# EAGLE board ESP32-P4 Display 9.0 inch V1.1 (EAGLE 9.6.2), part 1 of 3
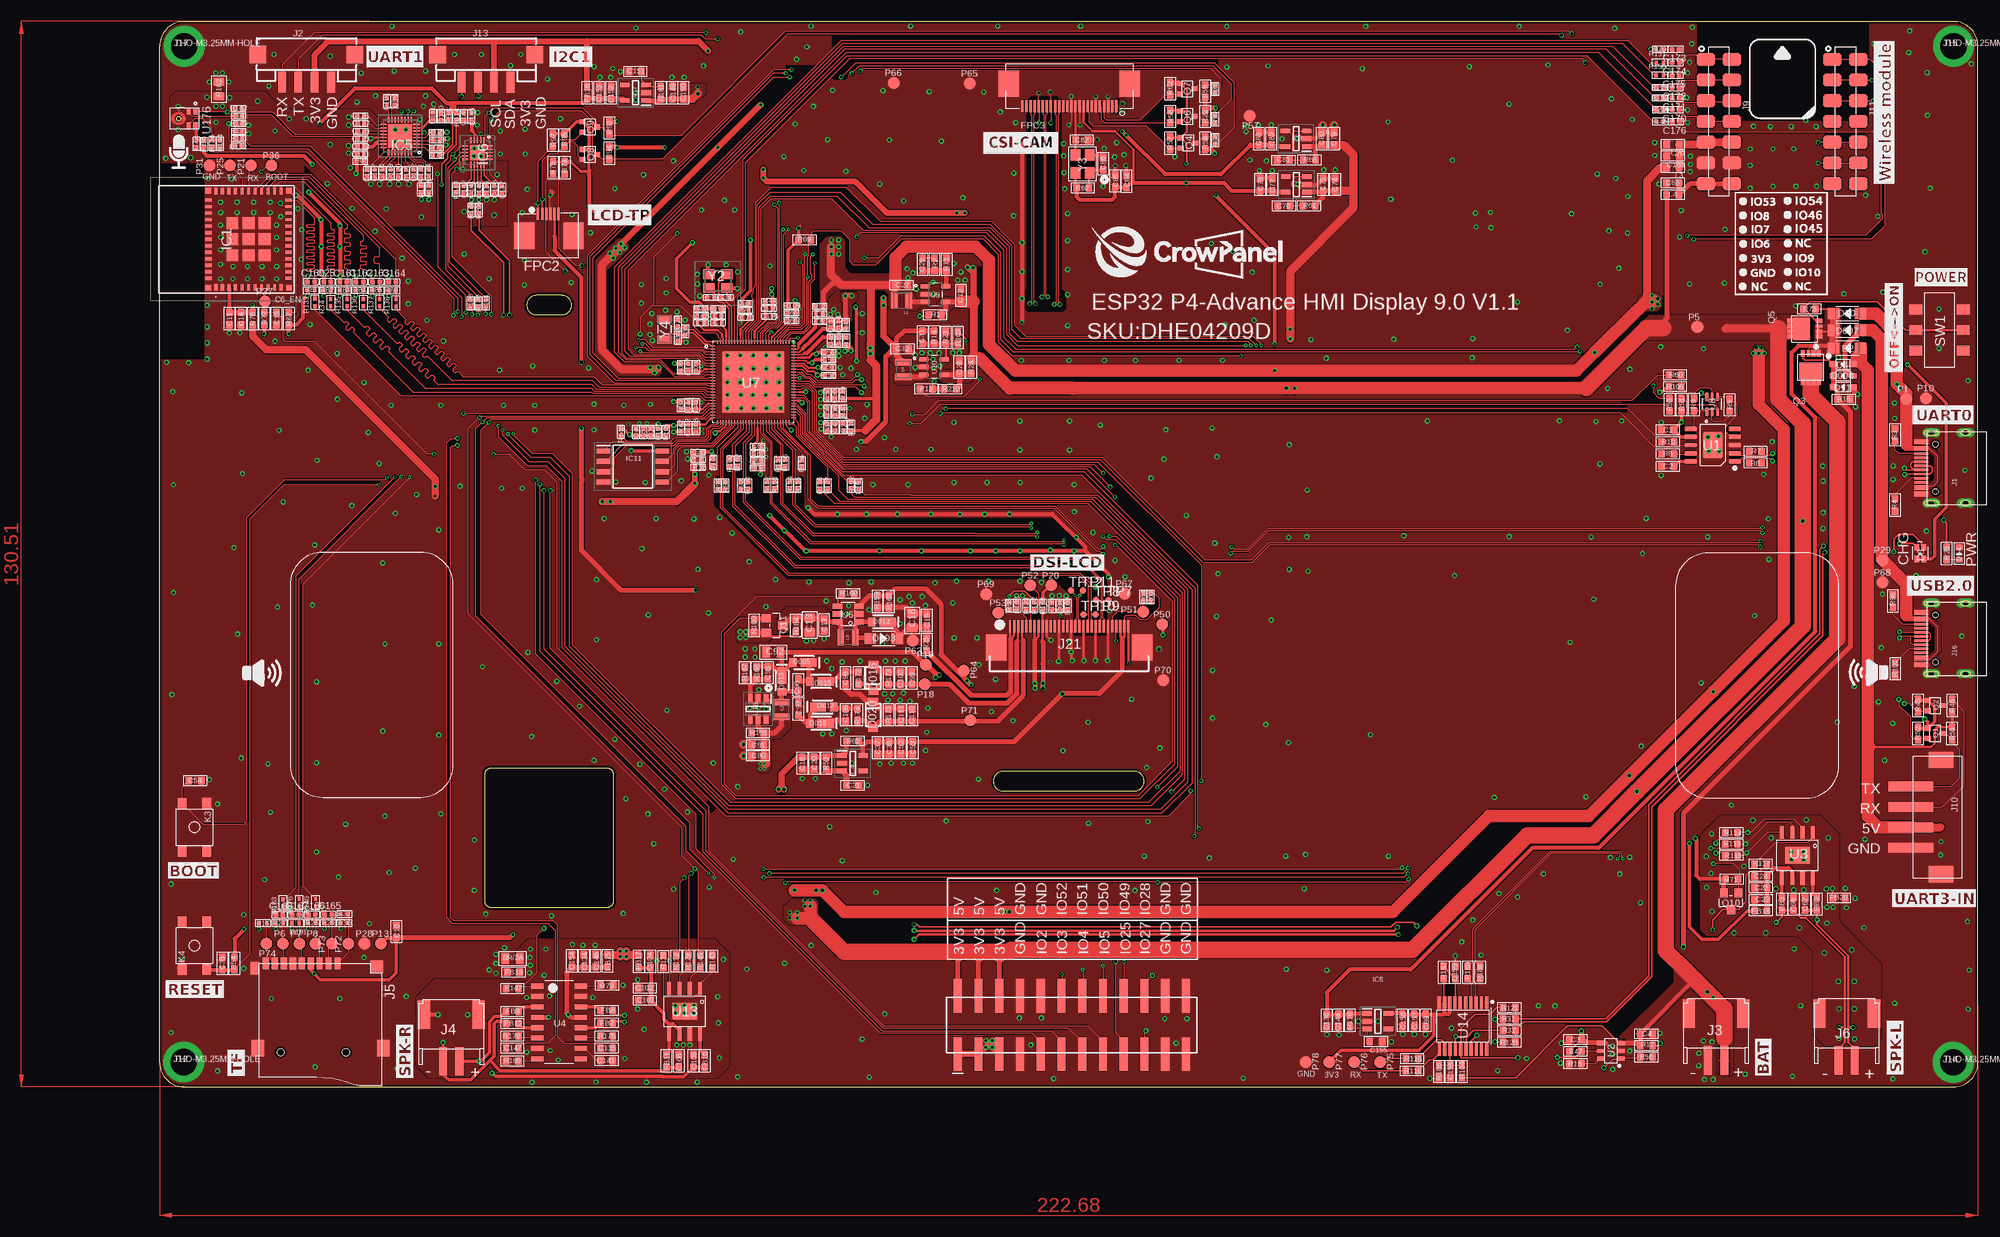
[diagram p9: board, top side]
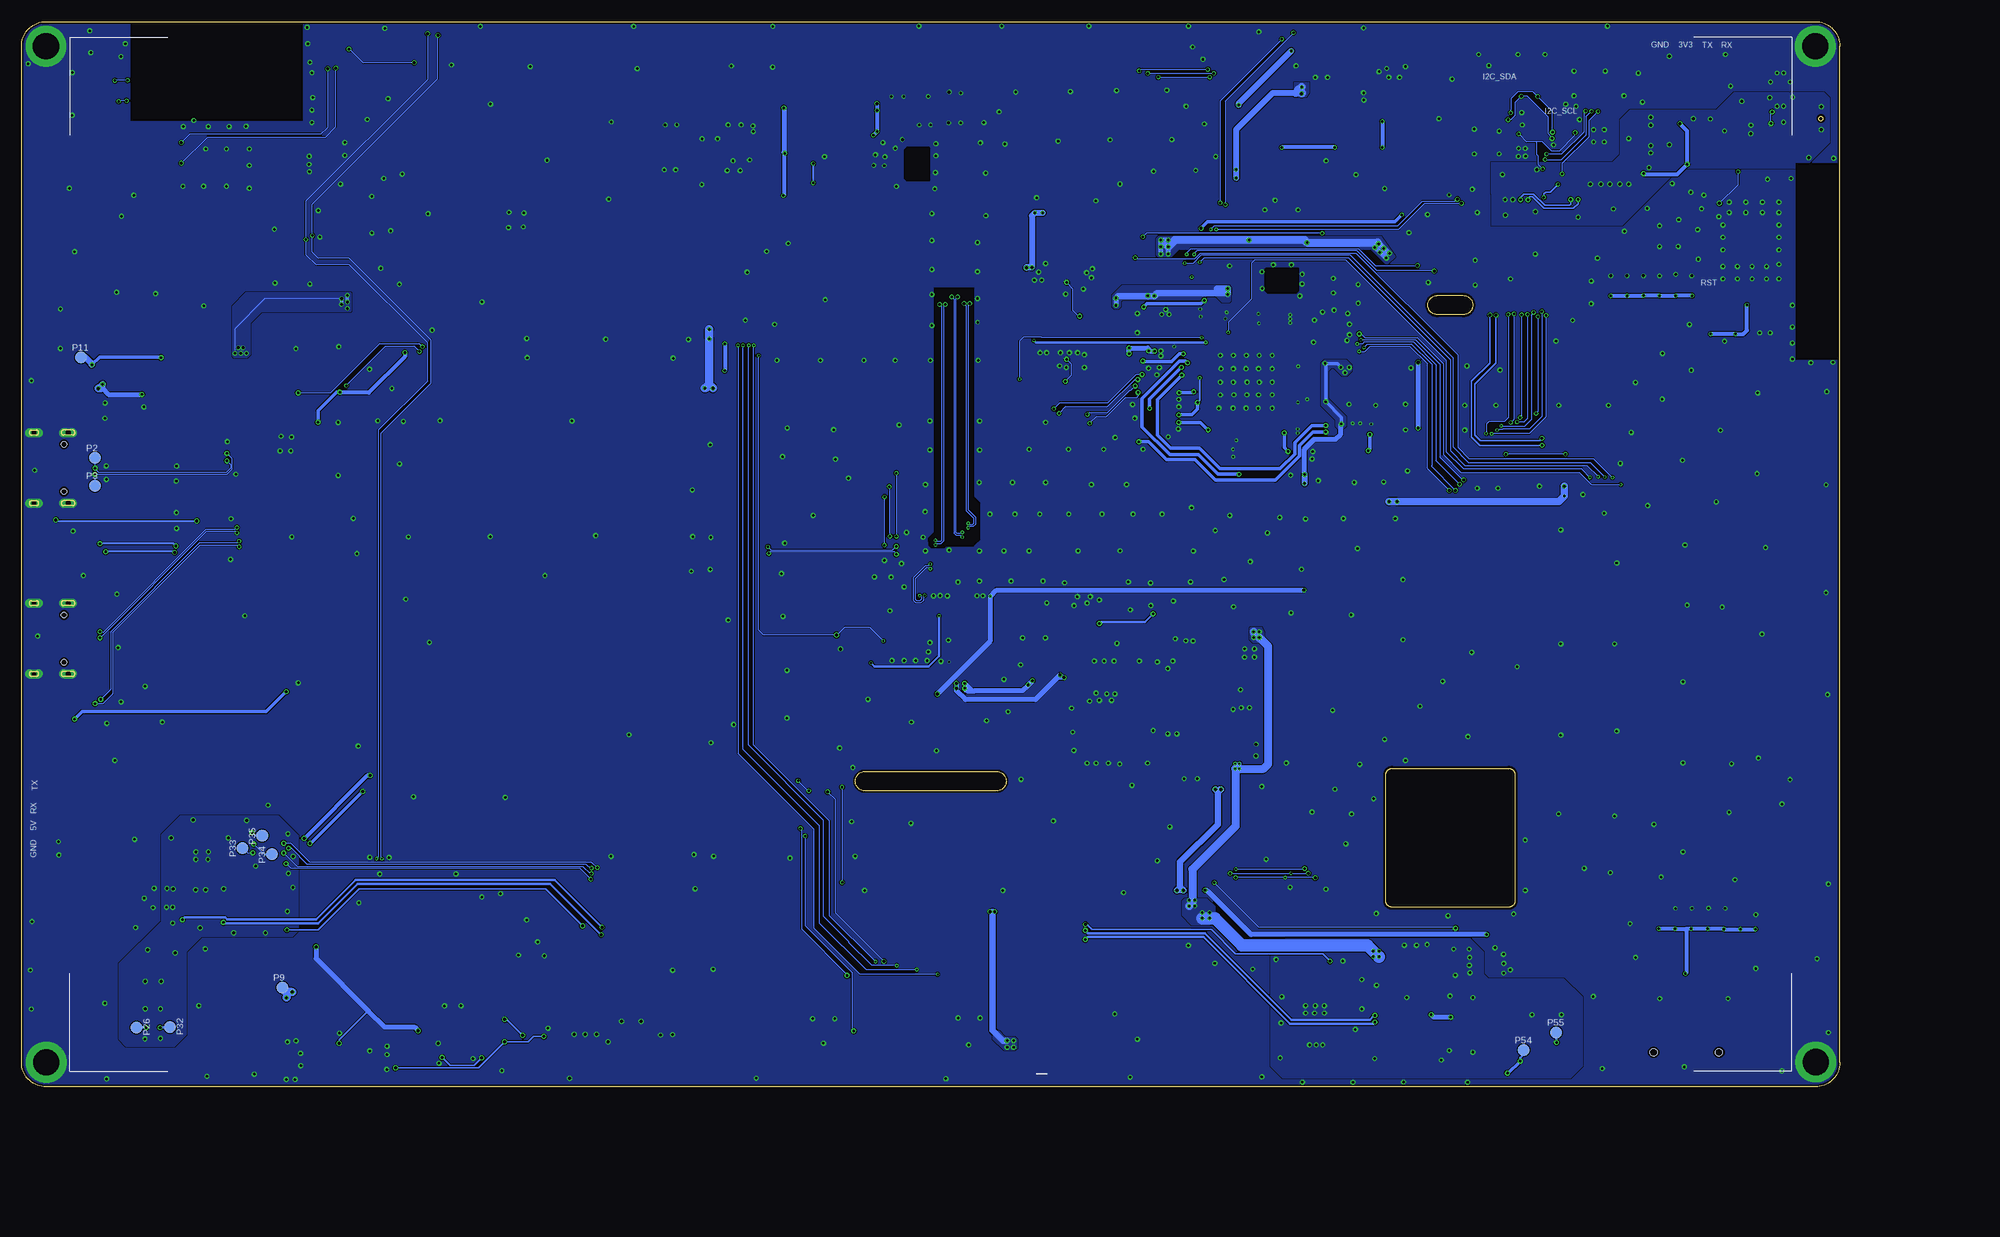
[diagram p10: board, bottom side, seen from below]

Size 222.7 x 130.5 mm. Coordinates in mm from the lower left corner, seen from the top.
Outline: 0,3 0,127.5 arc-90 3,130.5 219.7,130.5 arc-90 222.7,127.5 222.7,3 arc-90 219.7,0 3,0 arc-90 0,3
Outline: 103.28,36.26 119.4,36.26 arc180 119.4,38.64 103.28,38.64 arc180 103.28,36.26
Outline: 39.8,38.27 39.8,22.77 arc90 40.55,22.02 54.85,22.02 arc90 55.6,22.77 55.6,38.27 arc90 54.85,39.02 40.55,39.02 arc90 39.8,38.27
Outline: 46.14,94.58 49.26,94.58 arc180 49.26,96.96 46.14,96.96 arc180 46.14,94.58
Outline: circle at 2.32,118.62 radius 0.25
Copper layers (1*16): Top 0.035mm / dielectric 1.5mm / Bottom 0.035mm
Design rules "default *": minimum track width 4mil, minimum drill 0.2mm, track to track 4mil, track to pad 6mil, pad to pad 6mil, via to via 6mil, smd to smd 6mil, copper to edge 10mil, drill to drill 6mil, minimum pad ring 10mil, minimum via ring 4mil, stop-mask expansion 4mil, vias tented up to drill 100mil, thermal gap 10mil

## Footprints (pad centres in the part's own frame; a part is rotated, then mirrored left to right if it is on the bottom)
L0805 = smd 1.016 x 1.397: 1 -0.889,0; 2 0.889,0
0603 = smd 0.889 x 0.889: 1 -0.762,0; 2 0.762,0
C0402 = smd 0.6 x 0.6: 1 -0.45,0; 2 0.45,0
C0805 = smd 1.016 x 1.397: 1 -0.889,0; 2 0.889,0
C0402' = smd 0.635 x 0.635: 1 0,0.445; 2 0,-0.445
LED_KT-0603RYG = smd 0.85 x 0.6: 1 0.725,-0.425; 2 0.725,0.425; 3 -0.725,-0.425; 4 -0.725,0.425
D_SOD123FL = smd 1.397 x 1.397: + -1.651,0; - 1.651,0
D_SOD323 = smd 1 x 0.8: + -1.2,0; - 1.2,0
LMBR140ET1G = smd 2 x 1.1: 1 -0.975,0 | smd 0.9 x 1.1: 2 0.975,0
LED0603 = smd 0.762 x 0.889: + -0.762,0; - 0.762,0
LMSZ5233BT1G = smd 0.91 x 1.22: 1 -1.635,0; 2 1.635,0
L0603 = smd 0.889 x 0.889: 1 -0.762,0; 2 0.762,0
L0402 = smd 0.635 x 0.635: 1 -0.445,0; 2 0.445,0
R0402 = smd 0.635 x 0.635: 1 -0.445,0; 2 0.445,0
FPC-6PIN-0.5MM = smd 0.3 x 1.5: 1 -1.31,2.184; 2 -0.81,2.184; 3 -0.31,2.184; 4 0.19,2.184; 5 0.69,2.184; 6 1.19,2.184 | smd 2.5 x 3.2: 7 -3.01,-0.496; 8 3.036,-0.496
FPC-SMD_P0.50-24P_QCHF-SM-H2.0 = smd 0.3 x 1.5: 1 5.75,-1.574; 2 5.25,-1.574; 3 4.75,-1.574; 4 4.25,-1.574; 5 3.75,-1.574; 6 3.25,-1.574; 7 2.75,-1.574; 8 2.25,-1.574; 9 1.75,-1.574; 10 1.25,-1.574; 11 0.75,-1.574; 12 0.25,-1.574; 13 -0.25,-1.574; 14 -0.75,-1.574; 15 -1.25,-1.574; 16 -1.75,-1.574; 17 -2.25,-1.574; 18 -2.75,-1.574; 19 -3.25,-1.574; 20 -3.75,-1.574; 21 -4.25,-1.574; 22 -4.75,-1.574; 23 -5.25,-1.574; 24 -5.75,-1.574 | smd 2.5 x 3.2: 25 7.4,1.195; 26 -7.4,1.195
ESP32C6MINI1N4 = smd 0.8 x 0.4: 1 -5.9,4; 2 -5.9,3.2; 3 -5.9,2.4; 4 -5.9,1.6; 5 -5.9,0.8; 6 -5.9,0; 7 -5.9,-0.8; 8 -5.9,-1.6; 9 -5.9,-2.4; 10 -5.9,-3.2; 11 -5.9,-4; 25 5.9,-4; 26 5.9,-3.2; 27 5.9,-2.4; 28 5.9,-1.6; 29 5.9,-0.8; 30 5.9,0; 31 5.9,0.8; 32 5.9,1.6; 33 5.9,2.4; 34 5.9,3.2; 35 5.9,4 | smd 0.4 x 0.8: 12 -4.8,-4.9; 13 -4,-4.9; 14 -3.2,-4.9; 15 -2.4,-4.9; 16 -1.6,-4.9; 17 -0.8,-4.9; 18 0,-4.9; 19 0.8,-4.9; 20 1.6,-4.9; 21 2.4,-4.9; 22 3.2,-4.9; 23 4,-4.9; 24 4.8,-4.9; 36 4.8,4.9; 37 4,4.9; 38 3.2,4.9; 39 2.4,4.9; 40 1.6,4.9; 41 0.8,4.9; 42 0,4.9; 43 -0.8,4.9; 44 -1.6,4.9; 45 -2.4,4.9; 46 -3.2,4.9; 47 -4,4.9; 48 -4.8,4.9 | smd 1.45 x 1.45: 49 0,0; 54 -1.975,1.975; 55 -1.975,0; 56 -1.975,-1.975; 57 0,-1.975; 58 1.975,-1.975; 59 1.975,0; 60 1.975,1.975; 61 0,1.975 | smd 0.7 x 0.7: 50 5.95,4.95; 51 5.95,-4.95; 52 -5.95,-4.95; 53 -5.95,4.95
SOT95P282X145-5N = smd 1.2 x 0.6: 1 -1.3,0.95; 2 -1.3,0; 3 -1.3,-0.95; 4 1.3,-0.95; 5 1.3,0.95
QFN40P400X400X80-33N = smd 0.75 x 0.2: 1 -2,1.4; 2 -2,1; 3 -2,0.6; 4 -2,0.2; 5 -2,-0.2; 6 -2,-0.6; 7 -2,-1; 8 -2,-1.4; 17 2,-1.4; 18 2,-1; 19 2,-0.6; 20 2,-0.2; 21 2,0.2; 22 2,0.6; 23 2,1; 24 2,1.4 | smd 0.2 x 0.75: 9 -1.4,-2; 10 -1,-2; 11 -0.6,-2; 12 -0.2,-2; 13 0.2,-2; 14 0.6,-2; 15 1,-2; 16 1.4,-2; 25 1.4,2; 26 1,2; 27 0.6,2; 28 0.2,2; 29 -0.2,2; 30 -0.6,2; 31 -1,2; 32 -1.4,2 | smd 2.9 x 2.9: 33 0,0
QFN40P300X300X60-21N = smd 0.75 x 0.2: 1 -1.5,0.8; 2 -1.5,0.4; 3 -1.5,0; 4 -1.5,-0.4; 5 -1.5,-0.8; 11 1.5,-0.8; 12 1.5,-0.4; 13 1.5,0; 14 1.5,0.4; 15 1.5,0.8 | smd 0.2 x 0.75: 6 -0.8,-1.5; 7 -0.4,-1.5; 8 0,-1.5; 9 0.4,-1.5; 10 0.8,-1.5; 16 0.8,1.5; 17 0.4,1.5; 18 0,1.5; 19 -0.4,1.5; 20 -0.8,1.5 | smd 1.8 x 1.8: 21 0,0
SOIC127P790X216-8N = smd 1.65 x 0.65: 1 -3.6,1.905; 2 -3.6,0.635; 3 -3.6,-0.635; 4 -3.6,-1.905; 5 3.6,-1.905; 6 3.6,-0.635; 7 3.6,0.635; 8 3.6,1.905
USB-3.0TYPEC-SMD = smd 0.3 x 1.7: A1 -3.35,0.5; A4 -2.55,0.5; A5 -1.25,0.5; A6 -0.25,0.5; A7 0.25,0.5; A8 1.25,0.5; A9 2.55,0.5; A12 3.35,0.5; B1 3.05,0.5; B4 2.25,0.5; B5 1.75,0.5; B6 0.75,0.5; B7 -0.75,0.5; B8 -1.75,0.5; B9 -2.25,0.5; B12 -3.05,0.5 | drill 0.6 pad 1.016 long: P$1 -4.325,-0.72; P$2 4.325,-0.72; P$3 -4.325,-4.9; P$4 4.325,-4.9 | hole 0.68: -2.89,-1.22; 2.89,-1.22
CONNECTOR_4P-SMD-2.0 = smd 0.965 x 2.54: 1 -3,0; 2 -1,0; 3 1,0; 4 3,0 | smd 2.032 x 2.184: SS1 -5.946,3.4; SS2 5.946,3.4
PH2.0WT-2PIN = smd 1 x 3.5: P$1 -1,0; P$2 1,0 | smd 1.5 x 3.5: P$3 -3.35,-5.7; P$4 3.35,-5.7
9P-SMD-W/-RING = smd 1.524 x 0.762: 1 0,4.4; 2 0,3.3; 3 0,2.2; 4 0,1.1; 5 0,0; 6 0,-1.1; 7 0,-2.2; 8 0,-3.3; 9 0,-4.4 | smd 1.524 x 1.016: G1 0.6,-5.746 | smd 2.032 x 1.524: G2 10.373,-5.4; G3 10.373,10 | smd 1.524 x 1.524: G4 0.392,9.181 | hole 0.889: 10.9,-2.6; 10.9,5.4
2X12_SMD = smd 4.14 x 0.991: 1 -3.569,13.97; 2 3.569,13.97; 3 -3.569,11.43; 4 3.569,11.43; 5 -3.569,8.89; 6 3.569,8.89; 7 -3.569,6.35; 8 3.569,6.35; 9 -3.569,3.81; 10 3.569,3.81; 11 -3.569,1.27; 12 3.569,1.27; 13 -3.569,-1.27; 14 3.569,-1.27; 15 -3.569,-3.81; 16 3.569,-3.81; 17 -3.569,-6.35; 18 3.569,-6.35; 19 -3.569,-8.89; 20 3.569,-8.89; 21 -3.569,-11.43; 22 3.569,-11.43; 23 -3.569,-13.97; 24 3.569,-13.97
H7-2.54-18.28X2.5X5MM = smd 1.65 x 2.3: 1 -7.62,-1.58; 1-1 -7.62,1.58; 2 -5.08,-1.58; 2-2 -5.08,1.58; 3 -2.54,-1.58; 3-3 -2.54,1.58; 4 0,-1.58; 4-4 0,1.58; 5 2.54,-1.58; 5-5 2.54,1.58; 6 5.08,-1.58; 6-6 5.08,1.58; 7 7.62,-1.58; 7-7 7.62,1.58
XH2.54-4P-SMD = smd 1.2 x 5.5: 1 -3.75,-1.875; 2 -1.25,-1.875; 3 1.25,-1.875; 4 3.75,-1.875 | smd 2 x 3: 5 -7,1.875; 6 7,1.875
THO-M3.2*5MM-HOLE = drill 3.2 pad 5: P$1 0,0
C23398852_30P_0.5MM_下接_FC-05A30P11H20 = smd 0.3 x 1.5: 1 -7.25,1.3; 2 -6.75,1.3; 3 -6.25,1.3; 4 -5.75,1.3; 5 -5.25,1.3; 6 -4.75,1.3; 7 -4.25,1.3; 8 -3.75,1.3; 9 -3.25,1.3; 10 -2.75,1.3; 11 -2.25,1.3; 12 -1.75,1.3; 13 -1.25,1.3; 14 -0.75,1.3; 15 -0.25,1.3; 16 0.25,1.3; 17 0.75,1.3; 18 1.25,1.3; 19 1.75,1.3; 20 2.25,1.3; 21 2.75,1.3; 22 3.25,1.3; 23 3.75,1.3; 24 4.25,1.3; 25 4.75,1.3; 26 5.25,1.3; 27 5.75,1.3; 28 6.25,1.3; 29 6.75,1.3; 30 7.25,1.3 | smd 2.5 x 3.2: 31 8.95,-1.3; 32 -8.95,-1.3
KEY-4.5X4.5-SMD = smd 1.35 x 1.1: 1 -2.925,1.5; 2 -2.925,-1.5; 3 2.925,-1.5; 4 2.925,1.5
1008(2520) = smd 0.8 x 2: 1 -0.9,0; 2 0.9,0
TEST_PAD-1.5MM = smd 1.5 x 1.5: P$1 0,0
MOS_SOT323 = smd 0.635 x 0.762: 1 -0.635,-0.889; 2 0.635,-0.889; 3 0,0.889
PDFN3333 = smd 0.5 x 0.8: 1 -0.975,-1.725; 2 -0.325,-1.725; 4 0.975,-1.725; 5 0.975,1.725; 6 0.325,1.725; 7 -0.325,1.725; 8 -0.975,1.725 | smd 0.4 x 0.8: 3 0.325,-1.725 | smd 2.8 x 2: 9 0,0.4
PMOS_SOT23 = smd 1.016 x 1.143: 1 -0.889,-1.016; 2 0.889,-1.016; 3 0,1.016
R0603@1 = smd 0.889 x 0.889: 1 -0.762,0; 2 0.762,0
R0603 = smd 0.889 x 0.889: 1 -0.762,0; 2 0.762,0
0402 = smd 0.5 x 0.5: 1 -0.45,0; 2 0.45,0
R0603-SP = smd 0.889 x 0.889: 1 -0.762,0; 2 0.762,0
R0805 = smd 1.016 x 1.397: 1 -0.889,0; 2 0.889,0
SWITCH_6PIN_2P = smd 1.2 x 1.6: 1 2.5,-2.9; 2 0,-2.9; 3 -2.5,-2.9; 4 -2.5,2.9; 5 0,2.9; 6 2.5,2.9
TP08R = smd 0.8 x 0.8: TP 0,0
ESOP-10-EP-150MIL = smd 1.5 x 0.6: 1 -2.7,2; 2 -2.7,1; 3 -2.7,0; 4 -2.7,-1; 5 -2.7,-2; 6 2.7,-2; 7 2.7,-1; 8 2.7,0; 9 2.7,1; 10 2.7,2 | smd 2.4 x 3.2: EP 0,0
SOT23-6L = smd 0.5 x 0.9: 1 -0.961,-1.212; 2 -0.011,-1.212; 3 0.94,-1.212; 4 0.94,1.288; 5 -0.011,1.288; 6 -0.961,1.288
NS4168-ESOP-8 = smd 1.6 x 0.5: 1 -2.8,1.905; 2 -2.8,0.635; 3 -2.8,-0.635; 4 -2.8,-1.905; 5 2.8,-1.905; 6 2.8,-0.635; 7 2.8,0.635; 8 2.8,1.905 | smd 2 x 3: 9 0,0
SOP16 = smd 0.635 x 1.524: 1 0,0; 2 1.27,0; 3 2.54,0; 4 3.81,0; 5 5.08,0; 6 6.35,0; 7 7.62,0; 8 8.89,0; 9 8.89,5.334; 10 7.62,5.334; 11 6.35,5.334; 12 5.08,5.334; 13 3.81,5.334; 14 2.54,5.334; 15 1.27,5.334; 16 0,5.334
COOPER_SOT23-6 = smd 0.69 x 1.2: 1 -0.95,-1.3; 2 0,-1.3; 3 0.95,-1.3; 4 0.95,1.3; 5 0,1.3; 6 -0.95,1.3
IC_ESP32-P4NRW32 = smd 0.65 x 0.18: 1 -4.925,4.375; 2 -4.925,4.025; 3 -4.925,3.675; 4 -4.925,3.325; 5 -4.925,2.975; 6 -4.925,2.625; 7 -4.925,2.275; 8 -4.925,1.925; 9 -4.925,1.575; 10 -4.925,1.225; 11 -4.925,0.875; 12 -4.925,0.525; 13 -4.925,0.175; 14 -4.925,-0.175; 15 -4.925,-0.525; 16 -4.925,-0.875; 17 -4.925,-1.225; 18 -4.925,-1.575; 19 -4.925,-1.925; 20 -4.925,-2.275; 21 -4.925,-2.625; 22 -4.925,-2.975; 23 -4.925,-3.325; 24 -4.925,-3.675; 25 -4.925,-4.025; 26 -4.925,-4.375; 53 4.925,-4.375; 54 4.925,-4.025; 55 4.925,-3.675; 56 4.925,-3.325; 57 4.925,-2.975; 58 4.925,-2.625; 59 4.925,-2.275; 60 4.925,-1.925; 61 4.925,-1.575; 62 4.925,-1.225; 63 4.925,-0.875; 64 4.925,-0.525; 65 4.925,-0.175; 66 4.925,0.175; 67 4.925,0.525; 68 4.925,0.875; 69 4.925,1.225; 70 4.925,1.575; 71 4.925,1.925; 72 4.925,2.275; 73 4.925,2.625; 74 4.925,2.975; 75 4.925,3.325; 76 4.925,3.675; 77 4.925,4.025; 78 4.925,4.375 | smd 0.18 x 0.65: 27 -4.375,-4.925; 28 -4.025,-4.925; 29 -3.675,-4.925; 30 -3.325,-4.925; 31 -2.975,-4.925; 32 -2.625,-4.925; 33 -2.275,-4.925; 34 -1.925,-4.925; 35 -1.575,-4.925; 36 -1.225,-4.925; 37 -0.875,-4.925; 38 -0.525,-4.925; 39 -0.175,-4.925; 40 0.175,-4.925; 41 0.525,-4.925; 42 0.875,-4.925; 43 1.225,-4.925; 44 1.575,-4.925; 45 1.925,-4.925; 46 2.275,-4.925; 47 2.625,-4.925; 48 2.975,-4.925; 49 3.325,-4.925; 50 3.675,-4.925; 51 4.025,-4.925; 52 4.375,-4.925; 79 4.375,4.925; 80 4.025,4.925; 81 3.675,4.925; 82 3.325,4.925; 83 2.975,4.925; 84 2.625,4.925; 85 2.275,4.925; 86 1.925,4.925; 87 1.575,4.925; 88 1.225,4.925; 89 0.875,4.925; 90 0.525,4.925; 91 0.175,4.925; 92 -0.175,4.925; 93 -0.525,4.925; 94 -0.875,4.925; 95 -1.225,4.925; 96 -1.575,4.925; 97 -1.925,4.925; 98 -2.275,4.925; 99 -2.625,4.925; 100 -2.975,4.925; 101 -3.325,4.925; 102 -3.675,4.925; 103 -4.025,4.925; 104 -4.375,4.925 | smd 7.5 x 7.5: 105 0,0
SOP65P210X100-6N = smd 1.09 x 0.4: 1 -0.92,0.65; 2 -0.92,0; 3 -0.92,-0.65; 4 0.92,-0.65; 5 0.92,0; 6 0.92,0.65
SOT95P280X145-5N = smd 1.21 x 0.59: 1 -1.255,0.95; 2 -1.255,0; 3 -1.255,-0.95; 4 1.255,-0.95; 5 1.255,0.95
TSSOP20 = smd 1.572 x 0.41: 1 -2.872,2.275; 2 -2.872,1.625; 3 -2.872,0.975; 4 -2.872,0.325; 5 -2.872,-0.325; 6 -2.872,-0.975; 7 -2.872,-1.625; 8 -2.872,-2.275; 9 -2.872,-2.895; 10 -2.872,-3.545; 11 2.872,-3.515; 12 2.872,-2.865; 13 2.872,-2.215; 14 2.872,-1.565; 15 2.872,-0.915; 16 2.872,-0.265; 17 2.872,0.355; 18 2.872,1.005; 19 2.872,1.625; 20 2.872,2.275
SOT95P280X145-6N = smd 1.2 x 0.6: 1 -1.25,0.95; 2 -1.25,0; 3 -1.25,-0.95; 4 1.25,-0.95; 5 1.25,0; 6 1.25,0.95
MIC-SMD_5P-L3.5-W2.7 = smd 0.725 x 0.522: 1 -0.838,1.362; 2 -0.838,0.542; 3 0.838,0.542; 4 0.838,1.362 | smd 0.25 x 0.25: 5_1 0,-0.048
X322540MPB4SI = smd 1.4 x 1.2: 1 -1.1,-0.85; 2 1.1,-0.85; 3 1.1,0.85; 4 -1.1,0.85
24MHZ_1631-24003-BTKEYA = smd 1.4 x 1.2: 1 -1.1,-0.875; 2 1.1,-0.875; 3 1.1,0.875; 4 -1.1,0.875
NORDIC_NRF_XTAL_3215_N = smd 1 x 1.8: 1 -1.25,0; 2 1.25,0

## Placement (x,y rotation side)
0R/2A  0R/800mA  [L0805]  43.24,15.74 0 top
C1  1uF  [0603]  184.7,80.49 0 top
C2  1uF  [0603]  184.7,76.04 0 top
C3  1uF  [0603]  173.4,5.79 0 top
C4  10uF/NC  [0603]  182.1,6.5 180 top
C5  100nF  [C0402]  80.8,93.77 0 top
C6  10uF  [C0402]  80.82,94.68 180 top
C7  100nF  [C0402]  68.4,93.61 180 top
C8  10uF  [C0402]  68.4,94.45 0 top
C9  100nF  [C0402]  66.29,93.61 0 top
C10  1uF  [0603]  28.98,19.02 270 top
C11  100nF  [0603]  8.54,94.1 270 top
C12  10uF/10V+  [0603]  98.14,96.96 90 top
C13  22uF  [C0805]  79.62,56.59 270 top
C14  10uF  [0603]  9.97,94.1 90 top
C15  100nF  [0603]  14.29,94.1 270 top
C16  10uF  [0603]  78.7,39.65 90 top
C17  1uF  [0603]  81.37,56.59 90 top
C18  22uF  [C0805]  92.16,57.13 90 top
C19  100nF  [0603]  93.95,57.16 90 top
C20  100nF  [0603]  80.17,39.65 90 top
C21  100nF  [0603]  84.87,36.92 180 top
C22  1uF  [0603]  196.11,22.96 180 top
C23  47uF  [0603]  196.11,24.39 180 top
C24  47uF  [0603]  196.11,25.79 180 top
C25  10pF_NC  [C0402']  20.54,98.62 90 top
C26  22pF  [0603]  93.43,100.76 90 top
C27  10uF/10V+  [0603]  90.87,98.22 180 top
C28  10uF/10V+  [0603]  97.94,88.16 90 top
C29  12pF  [C0402]  63.47,93.61 90 top
C30  12pF  [C0402]  63.48,91.78 270 top
C31  22pF  [0603]  93.45,91.83 90 top
C32  10uF/10V+  [0603]  90.97,90.42 180 top
C33  15pF  [C0402]  67.5,96.71 180 top
C34  15pF  [C0402]  69.34,96.71 180 top
C35  100nF  [0603]  7.68,15.13 270 top
C36  100nF  [C0402]  82.72,82.71 90 top
C37  100nF  [0603]  87.91,41.55 90 top
C38  10uF  [0603]  89.35,41.55 90 top
C39  100nF  [C0402]  60.12,80.24 90 top
C40  100nF  [C0402]  58.32,80.24 90 top
C41  100nF  [C0402]  65.7,83.49 90 top
C42  10uF  [C0402]  66.3,94.46 180 top
C43  100nF  [C0402]  82.73,80.84 270 top
C44  10uF  [C0402]  64.75,83.49 270 top
C45  100nF  [C0402]  65.94,76.84 180 top
C46  100nF  [C0402]  82.22,91.4 270 top
C47  10uF  [C0402]  81.78,80.83 90 top
C48  10uF  [C0402]  83.16,91.4 90 top
C49  10uF  [C0402]  65.94,77.76 0 top
C50  100nF  [C0402]  81.78,84.75 270 top
C51  1uF  [C0402]  59.22,80.24 90 top
C52  100nF  [0603]  90.8,41.55 90 top
C53  100nF  [0603]  92.23,41.55 90 top
C54  100nF  [0603]  4.33,37.52 180 top
C55  1uF  [C0402]  81.78,82.72 90 top
C56  10uF  [C0402]  82.72,84.75 90 top
C57  1uF  [C0402]  81.93,88.13 0 top
C58  1uF  [C0402]  81.93,87.18 0 top
C59  1uF  [C0402]  81.93,89.08 0 top
C60  100nF  [C0402]  77.39,94.79 0 top
C61  100nF  [C0402]  71.71,95.12 180 top
C62  10nF  [C0402]  73.23,77.59 0 top
C63  100nF  [C0402]  73.23,78.46 0 top
C64  1uF  [C0402]  73.22,76.76 0 top
C65  1uF  [C0402]  77.39,93.87 0 top
C66  1uF  [C0402]  81.93,90 0 top
C67  1nF  [0603]  201.52,22.4 270 top
C68  1nF  [0603]  200.09,22.4 270 top
C69  1uF  [0603]  155.05,8.15 90 top
C70  10UF  [0603]  185.33,115.46 180 top
C71  10uF  [C0402]  71.73,94.24 0 top
C72  100nF  [C0402]  4.49,115.53 90 top
C73  100nF  [C0402]  65.7,88.17 90 top
C74  10uF  [0603]  143.97,110.54 270 top
C75  100nF  [0603]  142.5,110.54 270 top
C76  100nF  [0603]  137.68,107.92 0 top
C77  100nF  [0603]  136.26,110.54 270 top
C78  10uF  [0603]  134.77,110.54 270 top
C79  10uF  [0603]  143.84,116.14 270 top
C80  100nF  [0603]  142.33,116.14 270 top
C81  100nF  [0603]  137.62,113.52 0 top
C82  100nF  [0603]  136.14,116.14 270 top
C83  10uF  [0603]  134.64,116.14 270 top
C84  100nF  [0603]  118.41,110.96 270 top
C85  1nF  [0603]  117.02,110.98 270 top
C86  1uF  [0603]  115.57,113.08 270 top
C87  15pF  [0603]  112.94,116.02 180 top
C88  10UF_NC  [0603]  185.32,110.75 180 top
C89  22pF  [C0402]  28.77,120.72 90 top
C90  10uF/25V  [0603]  73.27,40.56 180 top
C91  100nF/50V  [0603]  73.26,41.94 180 top
C92  22uF/16V  [C0805]  75.15,53.27 180 top
C93  10nF/25V  [0603]  74.5,50.73 270 top
C94  10uF/25V  [C0402]  110.24,58.93 90 top
C95  100nF/50V  [C0402]  109.31,58.93 90 top
C96  1uF/25V  [0603]  78.22,49.25 90 top
C97  1uF/25V  [0603]  78.23,46.29 270 top
C98  1uF/50V  [0603]  84,50.09 270 top
C99  10uF/25V  [0603]  92.15,50.09 90 top
C100  100nF/50V  [0603]  90.73,50.09 90 top
C101  22pF  [C0402]  27.82,120.72 90 top
C102  1uF  [0603]  59.41,12.1 180 top
C103  47uF  [0603]  59.41,10.6 180 top
C104  47uF  [0603]  60.1,15.37 90 top
C105  1nF  [0603]  65.36,3.19 270 top
C106  1nF  [0603]  63.57,3.19 270 top
C107  10uF  [C0402]  64.75,88.17 270 top
C108  100nF  [C0402]  65.7,80.7 270 top
C109  1uF/50V  [0603]  84.01,45.58 270 top
C110  10uF/25V  [0603]  92.18,45.58 90 top
C111  100nF/50V  [0603]  90.78,45.58 90 top
C112  10uF  [C0402]  64.75,80.7 90 top
C113  100nF  [C0402]  82.16,93.35 90 top
C114  10uF  [C0402]  83.09,93.35 270 top
C115  100nF  [C0402]  74.63,95.34 0 top
C116  10uF  [C0402]  74.64,94.41 180 top
C117  1uF  [C0402]  26.36,111.92 90 top
C118  1uF  [C0402]  27.31,111.92 90 top
C119  1uF  [C0402]  28.25,111.92 90 top
C120  1uF  [C0402]  29.2,111.92 90 top
C121  1uF  [C0402]  30.14,111.92 90 top
C122  1uF  [C0402]  31.09,111.92 90 top
C123  1uF  [C0402]  32.03,111.92 90 top
C124  1uF  [C0402]  32.98,111.92 90 top
C125  1uF  [C0402]  24.59,116.12 180 top
C126  1uF  [C0402]  24.59,117.06 180 top
C127  1uF  [C0402]  24.59,118.01 180 top
C128  1uF  [C0402]  24.59,118.95 180 top
C129  1uF  [C0402]  25.41,111.91 270 top
C130  100nF  [C0402]  34.43,118.89 90 top
C131  1uF  [C0402]  33.48,118.91 270 top
C132  100nF  [C0402]  24.59,115.18 180 top
C133  1uF  [C0402]  24.58,114.27 0 top
C134  47uF  [0603]  51.97,15.43 270 top
C135  100nF  [0603]  54.74,4.74 0 top
C136  10uF  [0603]  142.95,8.15 90 top
C137  1uF  [C0402]  41.95,109.9 90 top
C138  1uF  [C0402]  41,109.91 270 top
C139  1uF  [C0402]  40.05,109.91 270 top
C140  1uF  [C0402]  39.11,109.91 270 top
C141  1uF  [C0402]  38.16,109.91 270 top
C142  1uF  [C0402]  37.22,109.91 270 top
C143  1uF  [0603]  54.74,3.24 180 top
C144  100nF  [0603]  144.35,8.15 90 top
C145  100nF  [C0402]  37.25,118.88 90 top
C146  1uF  [C0402]  38.19,118.87 270 top
C147  100nF  [0603]  43.2,4.77 180 top
C148  47uF  [0603]  53.39,15.45 270 top
C149  10uF  [0603]  62.8,121.78 270 top
C150  100nF  [0603]  64.14,121.78 270 top
C151  100nF  [0603]  58.25,124.38 0 top
C152  100nF  [0603]  55.29,121.78 270 top
C153  10uF  [0603]  53.82,121.78 270 top
C154  100nF  [0603]  50.49,15.43 90 top
C155  100nF  [0603]  148.97,5.57 180 top
C156  100nF  [0603]  152.21,8.15 90 top
C157  10uF  [0603]  153.64,8.15 90 top
C158  1nF  [0603]  158.08,1.89 90 top
C159  100nF  [0603]  158.67,14.01 270 top
C160  10pF_NC  [C0402']  18.56,98.62 90 top
C161  10pF_NC  [C0402']  22.52,98.59 90 top
C162  10pF_NC  [C0402']  24.5,98.62 90 top
C163  10pF_NC  [C0402']  26.51,98.62 90 top
C164  10pF_NC  [C0402']  28.49,98.59 90 top
C165  10pF_NC  [C0402']  20.63,21.1 90 top
C166  10pF_NC  [C0402']  18.65,21.1 90 top
C167  10pF_NC  [C0402']  16.65,21.1 90 top
C168  10pF_NC  [C0402']  14.67,21.08 90 top
C169  100nF  [0603]  185.34,114.04 180 top
C170  NC  [C0402']  185.68,119.72 270 top
C171  NC  [C0402']  185.68,121.12 270 top
C172  NC  [C0402']  185.67,122.43 270 top
C173  NC  [C0402']  185.68,127.1 270 top
C174  NC  [C0402']  185.69,125.48 270 top
C175  NC  [C0402']  185.66,123.92 270 top
C176  NC  [C0402']  185.71,118.23 270 top
D1  KT-0603RYG  [LED_KT-0603RYG]  215.63,65.38 270 top
D2  DSS34  [D_SOD123FL]  206.68,90.5 180 top
D003  NC/DSS34  [D_SOD123FL]  88.68,54.93 0 top
D4  1N5817WS  [D_SOD323]  206.17,88.52 180 top
D005  LMBR140ET1G  [LMBR140ET1G]  78.5,51.96 180 top
D007  DSS34  [D_SOD123FL]  206.68,92.67 180 top
D008  1N5817WS  [D_SOD323]  206.21,87.1 180 top
D10  DSS34  [D_SOD123FL]  206.68,94.72 180 top
D11  1N5817WS  [D_SOD323]  206.22,85.71 180 top
D012  LMBR140ET1G  [LMBR140ET1G]  88.18,56.96 180 top
D013  LMBR140ET1G  [LMBR140ET1G]  76.2,49.4 270 top
D14  Red  [LED0603]  220.42,65.35 90 top
D015  LMBR140ET1G  [LMBR140ET1G]  80.6,49.64 180 top
D016  MM1W18_18V  [LMSZ5233BT1G]  87.4,50.09 90 top
D017  LMBR140ET1G  [LMBR140ET1G]  81.61,46.56 0 top
D018  LMBR140ET1G  [LMBR140ET1G]  80.6,44.54 180 top
D020  LMSZ5233BT1G_-6V  [LMSZ5233BT1G]  87.38,45.58 270 top
FB2  1K/磁珠  [L0603]  202.96,22.4 270 top
FB3  1K/磁珠  [L0603]  198.68,22.4 270 top
FB4  0R/800mA  [L0402]  35.37,118.88 270 top
FB5  0R/800mA  [L0402]  24.56,113.37 0 top
FB6  0R/800mA  [L0402]  5.41,115.5 90 top
FB7  1K/磁珠  [L0603]  54.74,7.84 0 top
FB8  1K/磁珠  [L0603]  54.74,9.34 0 top
FB9  1K/磁珠  [L0603]  43.19,9.24 180 top
FB10  1K/磁珠  [L0603]  66.76,3.19 270 top
FB11  1K/磁珠  [L0603]  62.07,3.19 270 top
FB12  1K/磁珠  [L0603]  43.19,7.74 180 top
FB13  0R/800mA  [L0402]  36.26,109.92 270 top
FB14  0R/800mA  [R0402]  36.32,118.88 270 top
FB15  0R/2A  [L0603]  54.86,15.43 270 top
FB16  0R/800mA_NC  [L0603]  52.35,121.78 270 top
FB17  0R/2A  [L0603]  58.68,15.37 90 top
FB18  0R/2A  [L0603]  196.11,21.58 180 top
FB19  0R/2A  [L0603]  43.34,14.04 0 top
FB20  0R/2A  [L0603]  205.68,23.15 180 top
FPC2  FPC-6PIN-0.5MM  [FPC-6PIN-0.5MM]  47.66,104.74 0 top
FPC3  AFC24-S24FIA-00  [FPC-SMD_P0.50-24P_QCHF-SM-H2.0]  111.41,121.7 0 top
IC1  ESP32-C6-MINI-1-N4  [ESP32C6MINI1N4]  10.89,103.82 90 top
IC2  ME6211C18M5G-N  [SOT95P282X145-5N]  139.22,110.54 180 top
IC3  ME6211C28M5G-N  [SOT95P282X145-5N]  139.18,116.14 180 top
IC4  ME6211C18M5G-N_NC  [SOT95P282X145-5N]  84.87,39.65 0 top
IC5  ES7210  [QFN40P400X400X80-33N]  29.44,116.48 180 top
IC6  ES8311  [QFN40P300X300X60-21N]  38.93,114.45 270 top
IC7  ME6211C33M5G-N  [SOT95P282X145-5N]  58.28,121.78 180 top
IC8  ME6211C33M5G-N  [SOT95P282X145-5N]  149.2,8.05 0 top
IC11  W25Q128JVSIQ  [SOIC127P790X216-8N]  57.94,75.99 0 top
J1  TYPEC-3.0-16P-SMD  [USB-3.0TYPEC-SMD]  216.27,75.82 90 top
J2  HY2.0-4P-SMT  [CONNECTOR_4P-SMD-2.0]  17.99,123.07 0 top
J3  PH2.0WT-2PIN  [PH2.0WT-2PIN]  190.62,3.26 180 top
J4  PH2.0WT-2PIN  [PH2.0WT-2PIN]  35.71,3.16 180 top
J5  [9P-SMD-W/-RING]  17.41,15.13 270 top
J6  PH2.0WT-2PIN  [PH2.0WT-2PIN]  206.62,3.26 180 top
J7  CONN_12X22X12_SMD  [2X12_SMD]  111.72,7.59 90 top
J9  [H7-2.54-18.28X2.5X5MM]  190.96,118.25 270 top
J10  XH2.54-4P-SMT  [XH2.54-4P-SMD]  216.32,33.05 270 top
J11  [H7-2.54-18.28X2.5X5MM]  206.46,118.25 270 top
J12  THO-M3.25MM-HOLE  [THO-M3.2*5MM-HOLE]  2.94,3.04 0 top
J13  HY2.0-4P-SMT  [CONNECTOR_4P-SMD-2.0]  39.99,123.07 0 top
J14  THO-M3.25MM-HOLE  [THO-M3.2*5MM-HOLE]  219.68,3.01 0 top
J15  THO-M3.25MM-HOLE  [THO-M3.2*5MM-HOLE]  219.7,127.5 0 top
J16  TYPEC-3.0-16P-SMD  [USB-3.0TYPEC-SMD]  216.27,54.92 90 top
J17  THO-M3.25MM-HOLE  [THO-M3.2*5MM-HOLE]  3,127.49 0 top
J21  C23398852_30P_0.5MM_下接_FC-05A30P11H20  [C23398852_30P_0.5MM_下接_FC-05A30P11H20]  111.39,55.13 0 top
K3  KEY-4.5X4.5  [KEY-4.5X4.5-SMD]  4.27,31.79 270 top
K4  KEY-4.5X4.5  [KEY-4.5X4.5-SMD]  4.27,17.3 90 top
L1  2.2μH_C5179446  [1008(2520)]  90.86,96.32 180 top
L2  4.7uH_C45385206_2.4A  [1008(2520)]  76.18,46.25 90 top
L3  0R  [L0603]  185.33,112.59 180 top
L4  NC  [L0603]  185.32,109.29 180 top
L5  4.7uH_C45385206_2.4A  [1008(2520)]  84.31,55.08 0 top
L6  2.2μH_C5179446  [1008(2520)]  91.07,87.87 90 top
P1  TEST_PADPAD-1.5MM  [TEST_PAD-1.5MM]  213.93,84.27 0 top
P2  TEST_PADPAD-1.5MM  [TEST_PAD-1.5MM]  213.67,77.04 0 bottom
P3  TEST_PADPAD-1.5MM  [TEST_PAD-1.5MM]  213.68,73.64 0 bottom
P5  TEST_PADPAD-1.5MM  [TEST_PAD-1.5MM]  188.33,93.09 0 top
P6  TEST_PADPAD-1.5MM  [TEST_PAD-1.5MM]  15.09,17.55 0 top
P7  TEST_PADPAD-1.5MM  [TEST_PAD-1.5MM]  17.09,17.55 0 top
P8  TEST_PADPAD-1.5MM  [TEST_PAD-1.5MM]  19.09,17.55 0 top
P9  TEST_PADPAD-1.5MM  [TEST_PAD-1.5MM]  190.77,12.17 0 bottom
P10  TEST_PADPAD-1.5MM  [TEST_PAD-1.5MM]  216.34,84.37 0 top
P11  TEST_PADPAD-1.5MM  [TEST_PAD-1.5MM]  215.42,89.35 0 bottom
P13  TEST_PADPAD-1.5MM  [TEST_PAD-1.5MM]  27.09,17.55 0 top
P18  TEST_PADPAD-1.5MM  [TEST_PAD-1.5MM]  93.72,49.3 180 top
P19  TEST_PADPAD-1.5MM  [TEST_PAD-1.5MM]  93.83,51.74 0 top
P20  TEST_PADPAD-1.5MM  [TEST_PAD-1.5MM]  109.18,61.42 0 top
P21  TEST_PADPAD-1.5MM  [TEST_PAD-1.5MM]  11.17,112.85 90 top
P25  TEST_PADPAD-1.5MM  [TEST_PAD-1.5MM]  8.63,112.85 90 top
P26  TEST_PADPAD-1.5MM  [TEST_PAD-1.5MM]  208.61,7.27 270 bottom
P28  TEST_PADPAD-1.5MM  [TEST_PAD-1.5MM]  25.09,17.55 0 top
P29  TEST_PADPAD-1.5MM  [TEST_PAD-1.5MM]  211.03,64.54 0 top
P31  TEST_PADPAD-1.5MM  [TEST_PAD-1.5MM]  6.09,112.85 90 top
P32  TEST_PADPAD-1.5MM  [TEST_PAD-1.5MM]  204.53,7.32 270 bottom
P33  TEST_PADPAD-1.5MM  [TEST_PAD-1.5MM]  195.61,29.27 90 bottom
P34  TEST_PADPAD-1.5MM  [TEST_PAD-1.5MM]  192.02,28.49 90 bottom
P35  TEST_PADPAD-1.5MM  [TEST_PAD-1.5MM]  193.22,30.78 90 bottom
P36  TEST_PADPAD-1.5MM  [TEST_PAD-1.5MM]  13.71,112.85 0 top
P37  TEST_PADPAD-1.5MM  [TEST_PAD-1.5MM]  12.9,96.22 0 top
P50  TEST_PADPAD-1.5MM  [TEST_PAD-1.5MM]  122.81,56.66 0 top
P51  TEST_PADPAD-1.5MM  [TEST_PAD-1.5MM]  120.44,58.22 0 top
P52  TEST_PADPAD-1.5MM  [TEST_PAD-1.5MM]  106.64,61.44 0 top
P53  TEST_PADPAD-1.5MM  [TEST_PAD-1.5MM]  102.73,58.08 0 top
P54  TEST_PADPAD-1.5MM  [TEST_PAD-1.5MM]  38.71,4.5 0 bottom
P55  TEST_PADPAD-1.5MM  [TEST_PAD-1.5MM]  34.73,6.67 0 bottom
P57  TEST_PADPAD-1.5MM  [TEST_PAD-1.5MM]  133.53,118.96 180 top
P63  TEST_PADPAD-1.5MM  [TEST_PAD-1.5MM]  92.23,54.65 180 top
P64  TEST_PADPAD-1.5MM  [TEST_PAD-1.5MM]  98.48,51 270 top
P65  TEST_PADPAD-1.5MM  [TEST_PAD-1.5MM]  99.24,122.93 0 top
P66  TEST_PADPAD-1.5MM  [TEST_PAD-1.5MM]  89.91,123.01 0 top
P67  TEST_PADPAD-1.5MM  [TEST_PAD-1.5MM]  118.17,60.42 0 top
P68  TEST_PADPAD-1.5MM  [TEST_PAD-1.5MM]  211.03,61.79 0 top
P69  TEST_PADPAD-1.5MM  [TEST_PAD-1.5MM]  101.24,60.37 0 top
P70  TEST_PADPAD-1.5MM  [TEST_PAD-1.5MM]  122.92,49.82 0 top
P71  TEST_PADPAD-1.5MM  [TEST_PAD-1.5MM]  99.26,44.89 0 top
P72  TEST_PADPAD-1.5MM  [TEST_PAD-1.5MM]  23.09,17.55 90 top
P73  TEST_PADPAD-1.5MM  [TEST_PAD-1.5MM]  21.09,17.55 90 top
P74  TEST_PADPAD-1.5MM  [TEST_PAD-1.5MM]  13.09,17.55 180 top
P75  TEST_PADPAD-1.5MM  [TEST_PAD-1.5MM]  149.5,3.04 270 top
P76  TEST_PADPAD-1.5MM  [TEST_PAD-1.5MM]  146.31,3.04 270 top
P77  TEST_PADPAD-1.5MM  [TEST_PAD-1.5MM]  143.23,3.04 270 top
P78  TEST_PADPAD-1.5MM  [TEST_PAD-1.5MM]  140.35,3.04 270 top
Q1  BSS138W_SOT323  [MOS_SOT323]  217.45,43.3 270 top
Q2  BSS138W_SOT323  [MOS_SOT323]  217.45,46.7 270 top
Q3  XR65P02D  [PDFN3333]  202.23,88.12 180 top
Q4  BSS138W_SOT323  [MOS_SOT323]  125.95,115.62 270 top
Q5  XR65P02D  [PDFN3333]  201.48,92.86 90 top
Q6  BSS138W_SOT323  [MOS_SOT323]  125.85,118.87 270 top
Q7  BSS138W_SOT323  [MOS_SOT323]  125.85,122.26 270 top
Q8  BSS138W_SOT323  [MOS_SOT323]  52.68,114.2 270 top
Q9  BSS138W_SOT323  [MOS_SOT323]  52.68,117.59 270 top
Q10  AO3401  [PMOS_SOT23]  192.45,22.75 180 top
Q11  AO3401_NC  [PMOS_SOT23]  75.32,56.51 270 top
R1  10K  [R0603@1]  94.94,94.57 0 top
R2  100K  [R0603@1]  94.89,100.75 270 top
R3  5.1K  [R0603@1]  212.53,79.88 270 top
R4  5.1K  [R0603@1]  212.53,71.29 270 top
R5  10K  [R0603@1]  192.28,83.55 90 top
R6  0R  [R0603@1]  195.45,76.44 0 top
R7  0R  [R0603@1]  195.45,77.84 0 top
R8  0R  [R0603@1]  184.7,77.54 0 top
R9  10K  [R0603@1]  187.92,83.6 270 top
R10  0R  [R0603@1]  184.7,79.01 0 top
R11  22.1K  [R0603]  96.39,100.75 90 top
R12  0R  [R0402]  80.81,95.63 0 top
R13  0R  [R0603@1]  93.88,85.49 180 top
R14  NC/499K  [R0603]  94.86,91.83 270 top
R15  10K  [0402]  12.65,20.08 180 top
R16  2K  [R0603-SP]  173.39,2.86 0 top
R17  5.1K  [R0603@1]  182.1,5.06 0 top
R18  10K  [R0603@1]  206.28,84.24 180 top
R19  0R  [R0402]  68.4,95.3 180 top
R20  0R  [R0402]  66.28,95.32 0 top
R21  NC/499K  [R0603]  96.3,91.81 90 top
R22  4.7K  [R0603@1]  128.04,118.87 270 top
R23  0R  [C0402]  83.71,80.83 270 top
R24  0R  [R0603@1]  99.38,88.16 90 top
R25  0R  [R0603-SP]  93.94,54.18 270 top
R26  4.7K  [R0603@1]  218.87,65.35 90 top
R27  10K  [0402]  14.66,20.06 180 top
R28  10K  [0402]  18.65,20.08 180 top
R29  10K  [0402]  20.63,20.08 180 top
R30  10K  [0402]  22.64,20.07 180 top
R31  2K  [R0603-SP]  165.3,8.32 180 top
R32  2K  [R0603-SP]  165.3,6.91 180 top
R33  10K/NC  [0402]  22.64,21.14 0 top
R34  22R  [0402]  20.96,96.07 90 top
R35  NC/10M  [R0402]  64.38,92.55 90 top
R36  0R  [R0402]  63.84,88.17 90 top
R37  0R  [R0402]  63.84,83.49 90 top
R38  0R  [R0402]  65.94,75.87 180 top
R39  0R  [R0402]  83.68,84.75 270 top
R40  0R  [R0402]  83.7,82.71 90 top
R41  0R  [R0402]  71.73,95.97 180 top
R42  0R  [R0402]  63.84,80.7 270 top
R43  0R  [R0402]  84.03,93.35 90 top
R44  0R  [R0402]  74.63,96.25 0 top
R45  4.7K  [R0603@1]  215.34,46.7 270 top
R46  4.7K  [R0603@1]  219.54,46.7 90 top
R47  5.1K  [R0603@1]  173.39,4.36 180 top
R48  0R  [0402]  183.8,118.25 180 top
R49  0R  [0402]  183.75,127.1 180 top
R50  5.1K  [R0603@1]  182.1,3.67 0 top
R51  4.7K  [R0603@1]  219.53,43.3 270 top
R52  4.7K  [R0603@1]  215.35,43.3 270 top
R53  10K  [R0603@1]  81.64,39.65 90 top
R54  10K  [R0603@1]  9.16,15.12 270 top
R55  0R  [R0603@1]  184.92,83.58 270 top
R56  4.7K  [R0603@1]  123.75,118.87 270 top
R57  4.7K  [R0603@1]  123.75,115.62 270 top
R58  4.7K  [R0603@1]  128.03,115.62 90 top
R59  4.7K  [R0603@1]  128.03,121.98 90 top
R60  0R  [R0603@1]  185.6,87.21 180 top
R61  10K  [R0603@1]  140.76,107.92 0 top
R62  4.7K  [R0603@1]  123.75,122.26 270 top
R63  100K  [R0402]  121.39,60 90 top
R64  100K  [R0402]  120.46,60 270 top
R65  0R  [R0603@1]  84.87,42.38 180 top
R66  10K  [R0603@1]  140.82,113.53 0 top
R67  10K  [R0603@1]  113.05,110.14 180 top
R68  100K  [R0402]  104.08,58.94 90 top
R69  2K  [R0603-SP]  79,103.75 0 top
R70  0R  [R0402]  84.11,91.4 270 top
R71  10K  [R0603@1]  192.55,25.46 180 top
R72  10K  [R0402]  33.89,115.04 180 top
R73  10K  [R0402]  33.89,114.1 180 top
R74  2K  [R0603@1]  49.62,112.58 270 top
R75  2K/NC  [R0603@1]  48.19,112.58 270 top
R76  0R  [R0603@1]  11.39,94.1 270 top
R77  10K  [R0603@1]  12.83,94.1 270 top
R78  4.7K  [R0603@1]  202.04,95.29 0 top
R79  OR  [R0603-SP]  54.79,12.44 0 top
R80  0R  [R0402]  73.24,75.86 0 top
R81  51K  [0402]  18.56,97.59 0 top
R82  51K  [0402]  20.54,97.6 0 top
R83  51K  [0402]  22.52,97.58 0 top
R84  51K  [0402]  24.5,97.6 0 top
R85  51K  [0402]  26.51,97.58 0 top
R86  51K  [0402]  28.49,97.57 0 top
R87  10K  [R0603@1]  15.81,94.09 90 top
R88  0R  [R0402]  129.27,115.95 90 top
R89  0R  [R0402]  129.26,122.25 90 top
R90  0R  [R0402]  129.27,118.56 270 top
R91  10K  [R0603@1]  186.38,83.58 90 top
R92  0R  [R0402]  71.18,73.66 90 top
R93  2K  [R0603@1]  55.08,117.48 270 top
R94  2K  [R0603@1]  55.07,114.39 270 top
R95  0R  [R0402]  69.28,73.66 90 top
R96  5.1K  [R0603@1]  212.27,59.53 270 top
R97  2K  [R0603@1]  48.16,115.98 270 top
R98  2K  [R0603@1]  49.58,115.98 270 top
R99  0R  [R0402]  68.39,73.66 90 top
R100  0R  [R0402]  69.88,76.46 90 top
R101  5.1K  [R0603@1]  212.56,51.23 270 top
R102  0R  [R0402]  70.78,76.46 90 top
R103  0R  [R0603@1]  97.77,91.8 90 top
R104  4.02K  [R0402]  67.78,76.49 90 top
R105  0R  [R0402]  61.98,80.24 90 top
R106  10K  [R0603@1]  185.6,85.78 0 top
R107  0R_NC  [R0402]  61.03,80.24 90 top
R108  100K  [R0402]  105.05,58.94 270 top
R109  0R  [R0402]  77.39,95.66 0 top
R110  0R/NC  [R0402]  84.71,80.82 270 top
R111  0R/NC  [R0402]  39.94,95.98 90 top
R112  0R  [R0603@1]  63.26,15.4 270 top
R113  0R  [R0603@1]  192.49,29.75 0 top
R114  0R  [R0603@1]  192.49,31.15 0 top
R115  0R  [R0603@1]  192.49,28.35 0 top
R116  10K  [R0603@1]  145.78,8.15 90 top
R117  100K  [R0603@1]  196.08,27.31 0 top
R118  0R  [R0603@1]  153.4,3.47 0 top
R119  0R  [R0603@1]  153.38,1.98 0 top
R120  5.1K_NC  [R0603@1]  165.3,5.51 180 top
R121  5.1K_NC  [R0603@1]  165.3,9.73 180 top
R122  100K  [R0402]  107.1,58.94 90 top
R123  100K  [R0402]  106.13,58.94 270 top
R124  0R  [R0402]  33.89,115.99 180 top
R125  0R  [R0402]  33.89,116.93 180 top
R126  0R/NC  [R0402]  80.89,73.67 270 top
R127  0R  [R0402]  81.83,73.66 270 top
R128  0R/NC  [R0402]  38.04,95.98 90 top
R129  0R  [R0603@1]  64.72,15.4 270 top
R130  0R/NC  [R0402]  39.01,95.98 90 top
R131  10K  [R0402]  9.65,116.15 0 top
R132  OR  [R0402]  9.65,115.23 180 top
R133  22R  [0402]  19.01,96.1 90 top
R134  OR  [R0402]  6.46,115.55 270 top
R135  22R  [0402]  22.94,96.07 90 top
R136  22R  [0402]  24.95,96.07 90 top
R137  22R  [0402]  26.96,96.07 90 top
R138  22R  [0402]  28.94,96.04 90 top
R139  100K  [R0603@1]  61.67,15.35 90 top
R140  0R  [0402]  19.08,22.59 90 top
R141  OR  [R0402]  9.65,118.93 0 top
R142  OR  [R0402]  9.65,119.85 0 top
R143  50K  [R0603-SP]  67.69,15.4 270 top
R144  OR  [R0402]  7.39,115.53 90 top
R145  OR  [R0402]  9.65,117.99 0 top
R146  10K  [R0402]  56.49,80.24 90 top
R147  OR  [R0603-SP]  43.19,12.04 0 top
R148  0R  [R0402]  38.17,107.41 270 top
R149  0R  [R0603@1]  66.23,15.4 270 top
R150  22R  [0402]  183.73,123.92 0 top
R151  22R  [0402]  183.74,125.47 0 top
R152  100R  [R0402]  74.42,73.68 270 top
R153  100R  [R0402]  75.27,73.68 270 top
R154  100R  [R0402]  77.2,73.68 270 top
R155  100R  [R0402]  78.09,73.68 270 top
R156  100R  [R0402]  76.63,76.38 270 top
R157  100R  [R0402]  75.73,76.38 270 top
R158  4.02K  [R0402]  78.63,76.38 270 top
R159  1.4R  [R0603-SP]  87.91,59.46 90 top
R160  10K  [R0603@1]  84.31,60.43 0 top
R161  0R_NC  [R0402]  85.61,73.68 270 top
R162  0R  [R0402]  84.67,73.68 270 top
R163  NC  [R0603-SP]  89.31,59.46 90 top
R164  39k  [R0603@1]  159.49,1.89 90 top
R165  100K  [R0603@1]  73.26,43.36 180 top
R166  210K  [R0603]  73.1,50.73 90 top
R167  12K  [R0603]  71.67,50.72 270 top
R168  1.5K  [R0402]  108.19,58.92 270 top
R169  1K  [R0402]  111.21,58.93 270 top
R170  0R  [R0402]  32.97,109.96 90 top
R171  10K  [R0402]  9.65,117.06 0 top
R172  3.9K  [R0603]  85.61,50.09 90 top
R173  51K  [R0603@1]  89.27,50.09 270 top
R174  3.9K  [R0603]  85.46,45.58 90 top
R175  51K  [R0603@1]  89.27,45.58 270 top
R176  0R  [0402]  17.08,22.59 90 top
R177  0R  [R0402]  32.02,109.93 90 top
R178  20K  [R0603]  54.74,6.24 0 top
R179  20K  [R0603]  43.19,6.24 180 top
R180  10K  [R0603@1]  72.8,56.51 270 top
R181  10K  [R0603@1]  61.37,121.77 270 top
R182  0R  [R0805]  7.26,122.23 270 top
R183  0R  [0402]  15.1,22.54 90 top
R184  0R  [R0603@1]  77.91,56.51 90 top
R185  OR  [R0603-SP]  43.19,3.14 0 top
R186  100k  [R0603@1]  156.68,1.89 270 top
R187  39k  [R0603@1]  157.26,14.03 90 top
R188  0R  [R0603@1]  161.71,14.03 90 top
R189  0R  [R0603@1]  160.22,14.01 90 top
R190  0R  [R0402]  72.07,73.66 90 top
R191  10K  [0402]  16.65,20.06 180 top
R200  0R  [R0402]  39.1,107.41 270 top
R210  NC/10K  [R0603@1]  96.84,85.48 180 top
R216  22R  [R0402]  183.75,119.7 0 top
R217  22R  [R0402]  183.72,122.44 0 top
R332  22R  [R0402]  183.72,121.13 0 top
SW1  switch_6pin  [SWITCH_6PIN_2P]  217.98,92.7 90 top
TP7  TPTP08R  [TP08R]  116.23,59.67 0 top
TP8  TPTP08R  [TP08R]  114.69,59.65 0 top
TP9  TPTP08R  [TP08R]  114.63,57.88 0 top
TP10  TPTP08R  [TP08R]  113.12,57.87 0 top
TP11  TPTP08R  [TP08R]  113.1,60.83 0 top
TP12  TPTP08R  [TP08R]  111.59,60.81 0 top
U1  CH340K  [ESOP-10-EP-150MIL]  190.22,78.62 180 top
U2  TP4059-SOT23-6  [SOT23-6L]  177.76,4.43 90 top
U3  NS4168  [NS4168-ESOP-8]  200.58,28.37 270 top
U4  NS4263B  [SOP16]  46.24,12.34 270 top
U6  MT9201  [COOPER_SOT23-6]  84.31,57.92 90 top
U7  ESP32-P4NRW32  [IC_ESP32-P4NRW32]  72.69,86.35 0 top
U8  UMH3NTN  [SOP65P210X100-6N]  190.14,83.62 90 top
U9  MT3406_C22462728  [SOT95P280X145-5N]  95,97.09 0 top
U10  MT3406_C22462728  [SOT95P280X145-5N]  94.86,88.19 0 top
U13  NS4168  [NS4168-ESOP-8]  64.3,9.27 270 top
U14  STC8H1K08-36I  [TSSOP20]  160.26,7.46 270 top
U16  MT3608  [SOT95P280X145-6N]  73.29,46.3 270 top
U176  LMA3526B3811  [MIC-SMD_5P-L3.5-W2.7]  3.02,118.62 270 top
Y2  40MHZ  [X322540MPB4SI]  68.37,98.72 0 top
Y3  24Mhz  [24MHZ_1631-24003-BTKEYA]  113.04,113.04 90 top
Y4  32.768K  [NORDIC_NRF_XTAL_3215_N]  61.81,92.81 270 top

## Tracks (layer width: path | path; a pad name or v marks a point on that pad's centre or on a via)
3V3$
  Top 0.406: C2.2 186.04,76.62 U1.10
+5V_IN
  Top 0.152: 218.13,31.8
  Top 0.305: R51.1 217.71,44.06 217.39,43.75 217.39,42.05 216.99,41.65 209.39,41.65
  Top 0.406: R46.1 R51.1
  Top 0.61: D2.+ 207.37,89.54 D4.+
  Top 1: J10.3 218.13,31.8
  Top 1.5: J10.3 210.54,31.8 209.19,33.15 209.19,41.45 | 209.19,41.45 209.39,41.65 | 209.19,41.45 209.19,87.77 208.33,88.64 D2.+
+VBUS1  (via drill 0.3 pad 0.6, 0.35)
  Top 0.102: J1.A9 216.56,78.37 217.12,77.81 217.16,77.81 217.72,77.25 217.72,74.04 217.25,73.57 J1.B9
  Top 0.3: 214.45,78.04 214.42,78.07 213.99,78.5 213.99,78.65 | 214.81,78.37 214.43,78.74 213.91,78.74
  Top 0.305: J1.B4 214.42,78.07 | 214.45,78.04 213.8,78.04 213.52,78.32 | J1.A9 214.81,78.37 213.97,78.37 213.89,78.45 | J1.B4
  Top 0.508: P1.P$1 213.91,84.29 213.91,84.94
  Top 0.61: v207.97,84.82 207.42,85.36 D11.+
  Top 1: 213.91,78.46 213.89,78.45 | 213.99,78.65 213.91,78.74
  Top 1.5: D10.+ 210.23,94.72 212.78,92.18 v212.78,86.07 v213.3,85.55 213.91,84.94 213.91,78.74
  Bottom 0.61: v212.78,86.07 212.78,85.53 212.07,84.82 v207.97,84.82
  Bottom 0.813: v212.78,86.07 212.87,85.99
  Bottom 1: v213.3,85.55 213.06,85.55 212.99,85.62
  pour Top (no thermals): 216.37,78.51 216.93,78.51 218.02,77.42 218.02,74.26 216.91,73.14 216.37,73.14 216.37,73.53 217.41,74.43 217.41,77.17 216.37,78.2
+VBUS2
  Top 0.102: J16.A4 216.81,52.37 217.77,53.33 217.77,56.32 216.63,57.47 J16.A9
  Top 0.203: P29.P$1 211.01,64.54 210.89,64.65
  Top 0.3: J16.B4 214.98,57.17 | 214.98,57.17 214.55,57.17 | 214.55,57.17 213.68,57.17 213.38,57.47 214.25,57.47 | J16.A9 214.25,57.47 | 214.25,57.47 213.89,57.83 | 214.25,57.47 214.55,57.17 | 214.98,57.17 214.98,57.27 213.89,58.36
  Top 0.305: J16.B4 215.67,57.27
  Top 0.61: D007.+ 206.38,90.73 206.38,87.87 207.16,87.09 D008.+
  Top 1: 210.89,81.75 210.9,81.75 | 213.79,61.75 213.89,61.75
  Top 1.5: 213.89,61.75 213.89,58.36 213.89,57.83 | D007.+ 209.83,92.67 210.9,91.61 210.9,81.75 | 210.89,81.75 210.89,64.65 213.79,61.75
  pour Top (no thermals): 216.43,57.55 216.99,57.55 218.08,56.46 218.08,53.31 216.96,52.19 216.43,52.19 216.43,52.58 217.46,53.47 217.46,56.21 216.43,57.25
ADC_AVDD_3V3
  Top 0.203: IC5.22 26.69,115.88 26.46,115.65 | IC5.23 26.73,115.48 26.56,115.65
  Top 0.508: FB5.2 25.01,114.25 C133.2 C132.1 26.09,115.18 26.56,115.65 26.46,115.65
ADC_DVDD_3V3
  Top 0.203: IC5.7 31.46,117.49 32.14,117.49 32.17,117.52 32.26,117.52 31.83,117.08 IC5.6 | R73.1 34.43,114.19 34.68,114.19 35.88,115.39 35.88,117.93 FB4.2
  Top 0.254: R73.1 34.33,114.09
  Top 0.381: C130.1 33.09,118.43 32.18,117.52 32.17,117.52
  Top 0.406: C131.2 33.48,118.44 C130.1
  Top 0.508: C130.1 FB4.2
ADC_VBAT
  Top 0.2: U14.13 158.04,2.67 158.02,2.65 R186.1 C158.2 R164.2
AGND  (via drill 0.3 pad 0.6)
  Top 0.508: J4.P$4 v34.08,8.86 v34.09,8.85
  other vias: 37.69,8.85 48.82,3.29 47.84,4.44 56.97,3.46 53.04,10.94 44.94,10.94 45.29,13.98 45.34,15.84 56.74,12.44 63.14,9.94 64.24,9.94 65.44,9.94 63.14,9.04 64.34,9.04 65.44,9.04 58.54,13.14 64.94,5.14 63.34,5.14 64.14,5.14 69.06,15.61 60.88,15.43 53.34,17.34 51.84,17.34 50.54,17.44 45.4,16.88 45.38,14.89 44.94,4.24 47.74,11.14 68.34,11.04 68.44,7.84 58.54,9.54 59.34,7.04 68.54,3.54 47.3,16.88 47.1,13.68
  pour Bottom: 45.23,18.14 67.93,18.14 69.73,16.34 69.73,2.56 68.27,1.1 32.95,1.1 31.49,2.56 31.49,10.94 33.78,13.23 43.04,13.23 43.6,13.79 43.6,16.5
  pour Top (no thermals): 45.21,18.16 67.9,18.16 69.71,16.35 69.71,2.57 68.25,1.11 32.93,1.11 31.47,2.57 31.47,10.95 33.75,13.24 43.01,13.24 43.57,13.8 43.57,16.52
AGND1  (via drill 0.3 pad 0.6, 0.35 pad 0.6)
  Top 0.102: U176.5_1 2.98,118.82 | v2.29,120.09 2.29,119.69 2.47,119.51 2.47,119.44
  Top 0.12: R145.2 10.7,117.99 v10.89,117.8 | 25.98,116.28 v25.86,116.15 | 2.88,118.52 2.88,118.38 | IC6.10 37.23,113.65 37.15,113.56
  Top 0.2: IC5.21 25.98,116.28 | 37.15,113.56 37.15,112.4 v37.11,112.37
  other vias: 2.28,117.24 5.79,121.25 6.89,120.15 7.69,120.15 8.59,121.15 10.89,116.75 23.16,114.4 23.16,115.3 23.16,117.8 23.16,118.8 37.3,107.2 40.05,108.67 41,108.67 41.31,111.77 25.86,110.6 26.96,110.6 28.16,110.6 29.26,110.6 30.56,110.6 14.12,117.1 15.87,118.57 6.89,118.15 17.94,118.59 3.8,113.84 23.36,112.6 27.74,107.55 32.06,106.54 40.95,106.79 20.88,115.43 11.99,120.76
  pour Top (no thermals): 12.96,121.85 1.99,121.85 1.29,121.15 1.29,115.65 4.49,112.45 19.69,112.45 26.66,105.48 42.59,105.48 42.62,113.31 39.96,113.31 31.7,113.2 31.65,113.25 27.82,113.25 26.9,114.17 26.9,118.46 25.66,119.7 15.11,119.7
  pour Bottom (no thermals): 12.91,121.85 1.99,121.85 1.29,121.15 1.29,115.65 4.49,112.45 19.72,112.45 26.69,105.48 42.61,105.48 42.66,113.28 39.91,113.28 39.66,113.25 27.82,113.25 26.88,114.19 26.88,118.49 25.66,119.7 15.06,119.7
AGND3  (via drill 0.35 pad 0.6)
  Top 0.102: FB20.2 204.92,24.27 v204.89,24.3
  other vias: 204.95,22.01 204.17,22.01 204.14,24.28 199.81,28.77 201.34,28.77 199.86,27.85 201.34,27.88 201.38,24.11 200.15,24.11 192.83,18.89 196.72,18.89 200.82,19.5 203.87,16.43 205.57,12.91 205.68,9.55 205.68,5.95 207.58,5.87 207.56,9.55 207.56,12.91 207.25,16.79 204.2,20.06 204.35,30.48 201.7,32.69 195.1,32.63 189.41,28.23 190.01,26.17 190.07,31.01 189.46,24.42 194.01,27.04 197.36,30.48 197.92,24.25 190.13,21.48
  pour Bottom (no thermals): 191.2,33.22 203.27,33.22 205.62,30.87 205.62,20.23 210.79,15.06 210.79,5.86 209.92,5 203.91,5 202.49,6.42 202.49,16.62 200.64,18.47 189.47,18.47 188.74,19.19 188.74,30.76
  pour Top (no thermals): 191.23,33.25 203.3,33.25 205.65,30.9 205.65,20.25 210.81,15.08 210.81,5.89 209.95,5.03 203.94,5.03 202.52,6.45 202.52,16.65 200.67,18.49 189.5,18.49 188.77,19.22 188.77,30.79
AUDIO_CTRL  (via drill 0.35, 0.35 pad 0.6)
  Top 0.2: R117.2 196.02,26.49 194.86,26.49 194.29,25.92 194.29,22.65 193.38,21.73 Q10.3 191.48,21.73 190.19,20.45 v190.19,19.25 | R139.2 61.74,16.11 v62.44,15.41 | v92.4,19.9 92.74,19.9 93.07,19.57 150.82,19.57 151.41,20.16 153.54,20.16 v153.99,19.72
  Bottom 0.2: v92.4,19.9 92.23,19.9 91.6,19.27 76.98,19.27 74,16.29 63.32,16.29 v62.44,15.41 | v153.99,19.72 158.51,24.25 181.37,24.25 186.36,19.25 v190.19,19.25
AUDIO_OUT_3V3  (via drill 0.3 pad 0.6)
  Top 0.61: FB15.2 53.41,14.67 C148.2 53.37,14.67 C134.2 C154.1 49.84,14.02 49.84,9.04 v50.04,8.84 50.35,8.53 U4.13 | U4.4 46.25,8.54 v47.64,8.54
  Bottom 0.61: v47.64,8.54 49.74,8.54 v50.04,8.84
AUDIO_OUT_SD  (via drill 0.3, 0.3 pad 0.6)
  Top 0.12: U7.60 78.85,84.42 79.36,83.91 79.36,80.25 83.66,75.94 114,75.94 v116.42,73.52 | v190.29,27.35 190.34,27.39 192.75,27.39 193.49,26.65 193.49,25.64 R71.1 193.34,25.43 Q10.1 | R147.1 42.43,12.13 43.02,12.73 44.92,12.73 46.25,14.06 46.25,18.6 v47.08,19.43 | v116.34,67.45 117.15,67.45 124.67,59.93 124.67,39.19 v122.21,36.73 | v122.19,25.05 122.13,25.11 76.7,25.11 v76.6,25.01 | v122.19,25.05 | v122.19,25.05 152.59,25.05 v152.99,25.45
  Bottom 0.12: v116.42,73.52 116.42,67.52 v116.34,67.45 | v122.21,36.73 122.21,25.06 v122.19,25.05 | v47.08,19.43 47.22,19.56 71.15,19.56 v76.6,25.01 | v190.29,27.35 189.68,26.74 154.28,26.74 v152.99,25.45
AUDIO_VDD1
  Top 0.508: FB17.1 C104.1 60.17,14.54 C102.1 C103.1 61.74,9.04 61.74,8.34 62.34,7.74 62.84,7.74 63.67,6.92 U13.6
AUDIO_VDD2
  Top 0.508: FB18.1 C22.1 C23.1 C24.1 196.87,25.92 197.79,26.85 199.49,26.85 199.95,26.39 U3.6
AUDIO_VDD_3V3  (via drill 0.3 pad 0.6, 0.35)
  Top 0.508: FB6.1 5.41,114.41 5.75,114.07 17.62,114.07 v18.69,113 | FB5.1 24.12,111.95 v24.05,111.87 | v19.59,118 23.94,122.35 33.34,122.35 35.16,120.52 35.7,120.52 | FB16.2 51.84,120.52 36.1,120.52 | 36.1,120.52 35.7,120.52 | FB14.1 36.1,119.54 36.1,120.52 | FB4.1 35.7,119.66 35.7,120.52
  Top 0.61: FB16.2 C153.2 C152.2 56.79,121.02 IC7.5
  Bottom 0.508: v24.05,111.87 23.95,111.77 19.92,111.77 v18.69,113 18.69,117.09 v19.59,118
AVDD_2V8  (via drill 0.3, 0.35)
  Top 0.3: FPC3.2 116.66,120.26
  Top 0.508: 133.56,115.37 129.97,111.78 123.17,111.78 v118.37,116.58 v117.92,117.04
  Top 0.61: IC3.5 136.33,115.19 C82.2 C83.2 134.63,115.37 133.56,115.37
  Bottom 0.508: v117.93,120.45 117.92,120.44 v117.92,117.04 v118.37,116.58
  other vias: 117.9,119.62
  pour Top: 116.55,119.3 118.2,119.3 118.35,119.45 118.35,120.69 118.12,120.92 118.04,121 116.55,121 116.55,119.32
C6_BOOT  (via drill 0.3, 0.35 pad 0.6)
  Top 0.12: IC1.23 15.17,107.82 v14.75,108.24 | v12.46,112.11 13.2,112.85 P36.P$1
  Bottom 0.12: 14.69,108.3 v14.75,108.24 12.46,110.53 v12.46,112.11
C6_EN  (via drill 0.3)
  Top 0.12: U7.63 78.64,85.47 78.85,85.68 79.37,85.68 79.89,85.16 79.89,80.34 83.71,76.53 114.95,76.53 127.58,63.9 v127.58,37.5 | C15.1 14.27,94.89 | v126.28,36.27 126.28,35.86 123.63,33.22 69.29,33.22 48.6,53.9 48.6,74.09 47.08,75.61 44.71,75.61 42.81,77.51 v40.9,77.51 | C15.1 R77.1 | R77.1 12.49,95.2 | IC1.8 12.49,97.25 12.9,96.84 P37.P$1 12.83,96.15 R77.1 | C15.1 15.05,94.1 15.05,91.61 15.31,91.35 18.91,91.35 32.74,77.51 v33.61,77.51
  Bottom 0.12: v127.58,37.5 126.35,36.27 v126.28,36.27 | v33.61,77.51 v40.9,77.51
C6_IO8
  Top 0.12: IC1.22 16.4,107.02 16.63,106.8 16.63,94.91 16.57,94.85 R87.2
C6_RXD0
  Top 0.12: P21.P$1 11.13,112.85 10.89,112.62 IC1.30
C6_SD2_CLK
  Top 0.12: IC1.25 14.89,110.21 15.09,110.41 16.39,110.41 20.99,105.81 20.99,105.18 arc90 21.18,104.99 21.25,104.99 arc-90 21.44,104.8 21.44,104.78 arc-90 21.25,104.59 20.73,104.59 arc90 20.54,104.4 20.54,104.38 arc90 20.73,104.19 21.25,104.19 arc-90 21.44,104 21.44,103.98 arc-90 21.25,103.79 20.73,103.79 arc90 20.54,103.6 20.54,103.58 arc90 20.73,103.39 21.25,103.39 arc-90 21.44,103.2 21.44,103.18 arc-90 21.25,102.99 20.73,102.99 arc90 20.54,102.8 20.54,102.78 arc90 20.73,102.59 21.25,102.59 arc-90 21.44,102.4 21.44,102.38 arc-90 21.25,102.19 20.73,102.19 arc90 20.54,102 20.54,101.98 arc90 20.73,101.79 21.25,101.79 arc-90 21.44,101.6 21.44,101.58 arc-90 21.25,101.39 20.73,101.39 arc90 20.54,101.2 20.54,101.18 arc90 20.73,100.99 21.25,100.99 arc-90 21.44,100.8 21.44,100.78 arc-90 21.25,100.59 20.73,100.59 arc90 20.54,100.41 20.54,100.38 arc90 20.73,100.19 21.25,100.19 arc-90 21.44,100.01 21.44,99.98 arc-90 21.25,99.79 21.18,99.79 arc90 20.99,99.61 C25.2 R82.2 20.96,97.58 R34.2
C6_SD2_CMD
  Top 0.12: R133.2 R81.2 C160.2 19.01,99.68 arc90 18.82,99.86 18.2,99.86 arc-90 18.02,100.05 18.02,100.06 arc-90 18.2,100.25 18.82,100.25 arc90 19.01,100.44 19.01,100.45 arc90 18.82,100.63 18.2,100.63 arc-90 18.02,100.82 18.02,100.83 arc-90 18.2,101.02 18.82,101.02 arc90 19.01,101.21 19.01,101.22 arc90 18.82,101.41 18.2,101.41 arc-90 18.02,101.59 18.02,101.6 arc-90 18.2,101.79 18.82,101.79 arc90 19.01,101.98 19.01,101.99 arc90 18.82,102.18 18.2,102.18 arc-90 18.02,102.36 18.02,102.38 arc-90 18.2,102.56 18.82,102.56 arc90 19.01,102.75 19.01,102.76 arc90 18.82,102.95 18.2,102.95 arc-90 18.02,103.14 18.02,103.15 arc-90 18.2,103.33 18.82,103.33 arc90 19.01,103.52 19.01,103.53 arc90 18.82,103.72 18.2,103.72 arc-90 18.02,103.91 18.02,103.92 arc-90 18.2,104.11 18.82,104.11 arc90 19.01,104.29 19.01,104.3 arc90 18.82,104.49 18.2,104.49 arc-90 18.02,104.68 18.02,104.69 arc-90 18.2,104.88 18.82,104.88 arc90 19.01,105.06 19.01,105.08 arc90 18.82,105.26 18.2,105.26 arc-90 18.02,105.45 18.02,105.46 arc-90 18.2,105.65 18.82,105.65 arc90 19.01,105.84 19.01,106.4 16.78,108.62 IC1.24
C6_SD2_D0
  Top 0.12: IC1.26 14.09,110.3 14.68,110.89 17.72,110.89 22.97,105.64 22.97,105.26 arc-90 22.79,105.07 arc90 22.6,104.88 22.6,104.72 arc90 22.79,104.53 23.16,104.53 arc-90 23.35,104.34 23.35,104.18 arc-90 23.16,103.99 22.79,103.99 arc90 22.6,103.81 22.6,103.64 arc90 22.79,103.46 23.16,103.46 arc-90 23.35,103.27 23.35,103.11 arc-90 23.16,102.92 22.79,102.92 arc90 22.6,102.73 22.6,102.57 arc90 22.79,102.38 23.16,102.38 arc-90 23.35,102.19 23.35,102.03 arc-90 23.16,101.84 22.79,101.84 arc90 22.6,101.66 22.6,101.49 arc90 22.79,101.31 23.16,101.31 arc-90 23.35,101.12 23.35,100.96 arc-90 23.16,100.77 22.79,100.77 arc90 22.6,100.58 22.6,100.42 arc90 22.79,100.23 arc-90 22.97,100.04 C161.2 R83.2 22.94,97.56 R135.2
C6_SD2_D1
  Top 0.12: IC1.27 13.29,110.15 14.33,111.19 18.05,111.19 24.92,104.32 24.92,103.74 arc-90 24.74,103.55 24.72,103.55 arc90 24.53,103.36 24.53,103.26 arc90 24.72,103.07 25.13,103.07 arc-90 25.31,102.88 25.31,102.78 arc-90 25.13,102.59 24.72,102.59 arc90 24.53,102.41 24.53,102.3 arc90 24.72,102.12 25.13,102.12 arc-90 25.31,101.93 25.31,101.83 arc-90 25.13,101.64 24.72,101.64 arc90 24.53,101.45 24.53,101.35 arc90 24.72,101.16 25.13,101.16 arc-90 25.31,100.97 25.31,100.87 arc-90 25.13,100.68 24.72,100.68 arc90 24.53,100.5 24.53,100.39 arc90 24.72,100.21 24.74,100.21 arc-90 24.92,100.02 24.92,98.64 C162.2 R84.2 R136.2
C6_SD2_D2
  Top 0.12: IC1.28 12.49,110.01 13.96,111.47 18.3,111.47 26.96,102.81 26.96,101.9 arc-90 26.77,101.71 26.49,101.71 arc90 26.3,101.52 26.3,101.04 arc90 26.49,100.85 26.77,100.85 arc-90 26.96,100.67 26.96,98.68 | 26.96,98.68 C163.2 | R137.2 R85.2 26.96,98.68
C6_SD2_D3
  Top 0.12: IC1.29 11.69,109.82 13.66,111.79 18.47,111.79 28.94,101.32 C164.2 R86.2 R138.2
C6_TXD0
  Top 0.12: IC1.31 10.09,111.39 P25.P$1
C6_VDD_3V3  (via drill 0.3)
  Top 0.508: IC1.3 8.49,94.91 C11.1 | R81.1 18.11,96.93 v18.1,96.92 17.54,96.36 17.54,94.18 16.69,93.33 R87.1 v15.81,92.22 | v20.1,96.92 20.09,96.94 R82.1 | R83.1 22.07,96.94 v22.08,96.92 | v24.04,96.95 24.04,97.58 R84.1 | R85.1 v26.06,96.92 v26.06,96.91 | v28.05,96.9 28.04,96.92 R86.1 | R77.2 12.79,93.3 v12.79,92.22 | v11.39,95.78 R76.1
  Top 0.61: R76.1 C11.1 C14.2
  Bottom 0.508: v18.1,96.92 v20.1,96.92 v22.08,96.92 22.11,96.95 v24.04,96.95 24.07,96.91 v26.06,96.91 28.04,96.91 v28.05,96.9 | v15.81,92.22 v12.79,92.22 11.82,92.22 11.39,92.65 v11.39,95.78
CODEC_3V3  (via drill 0.3)
  Top 0.2: 38.53,115.83 IC6.4 | FB13.2 36.08,109.47
  Top 0.203: 38.39,117.04 38.53,116.9 38.53,116.8 | IC6.3 38.93,116.4 38.53,116.8 | IC6.4 38.53,116.8 | FB14.2 36.32,115.4 35.29,114.37 35.29,113.77 34.56,113.04 34.56,110.56 v34.53,110.53 | v36.26,108.97 FB13.2
  Top 0.406: FB14.2 | FB14.2 C145.1 38.18,118.43 C146.2
  Top 0.508: C146.2 38.19,117.24 38.39,117.04
  Bottom 0.203: v34.53,110.53 35.44,109.62 36.03,109.62 36.26,109.39 v36.26,108.97
CSI_CLK_N  (via drill 0.2, 0.35)
  Top 0.12: R156.2 76.29,75.6 76.29,71.54 80.07,67.76 89.7,67.76 89.89,67.78 | FPC3.19 108.16,119.14 108.3,119 108.3,97.01 v108.06,96.77 | 89.89,67.78 | 99.97,67.78 89.89,67.78 | 99.97,67.78 | 99.97,67.78 100.47,67.78 100.49,67.76 107.2,67.76 107.39,67.95 v107.48,67.95
  Bottom 0.12: v108.06,96.77 108.3,96.53 108.3,67.96 108.1,67.77 107.67,67.77 v107.48,67.95
CSI_CLK_P  (via drill 0.2, 0.35)
  Top 0.12: R157.2 76.07,75.6 76.07,71.45 79.98,67.54 89.7,67.54 89.89,67.54 90.25,67.54 90.27,67.56 100.28,67.56 100.38,67.56 100.4,67.54 107.31,67.54 v107.49,67.36 | FPC3.18 108.66,119.14 108.52,119 108.52,97.01 v108.76,96.77
  Bottom 0.12: v108.76,96.77 108.52,96.53 108.52,67.86 108.21,67.55 107.67,67.55 v107.49,67.36
CSI_D0_N  (via drill 0.2, 0.35)
  Top 0.12: R152.2 74.74,72.92 74.74,71.51 79.67,66.57 110.57,66.57 v110.75,66.39 | FPC3.16 109.66,119.14 109.8,119 109.8,96.1 v109.56,95.85
  Bottom 0.12: v109.56,95.85 109.8,95.61 109.8,66.84 110.07,66.57 110.58,66.57 v110.75,66.39
CSI_D0_P  (via drill 0.2, 0.35)